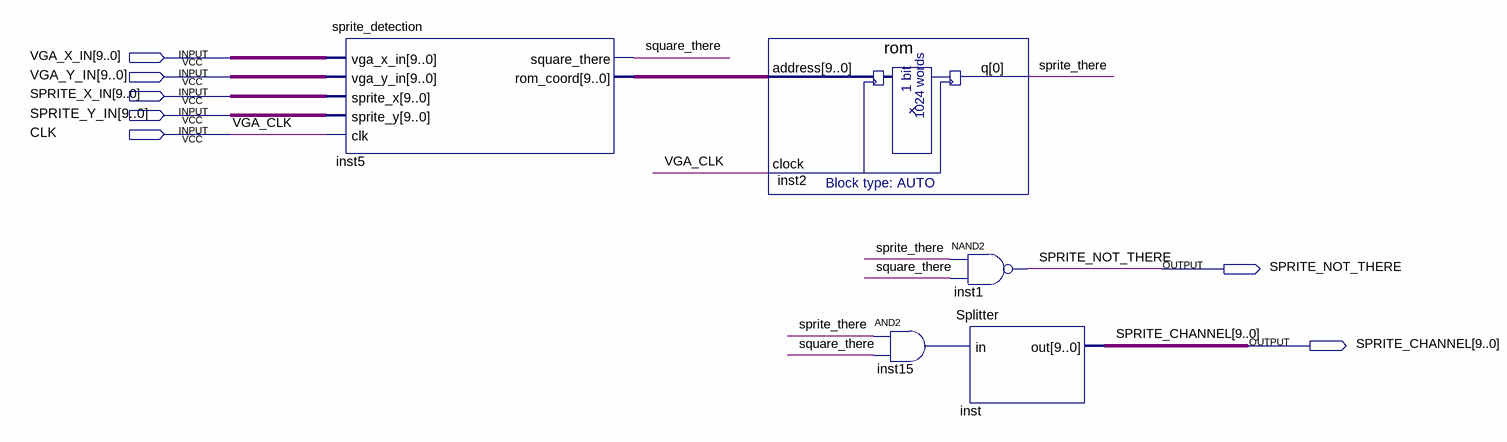
[diagram p0: schematic sheet]
// Quartus schematic sprite1.bdf as structural Verilog: 5 symbols, 7 pins
module sprite1 (
  input  [9:0] VGA_X_IN,
  input  [9:0] VGA_Y_IN,
  input  [9:0] SPRITE_X_IN,
  input  [9:0] SPRITE_Y_IN,
  input  CLK,
  output SPRITE_NOT_THERE,
  output [9:0] SPRITE_CHANNEL
);

  wire inst15_out, sprite_there, square_there;
  wire [9:0] inst5_rom_coord;

  sprite_detection inst5 (
    .vga_x_in(VGA_X_IN), .vga_y_in(VGA_Y_IN), .sprite_x(SPRITE_X_IN), .sprite_y(SPRITE_Y_IN), .clk(CLK),
    .square_there(square_there), .rom_coord(inst5_rom_coord));
  rom inst2 (.address(inst5_rom_coord), .clock(CLK), .q(sprite_there));
  and inst15 (inst15_out, sprite_there, square_there);
  nand inst1 (SPRITE_NOT_THERE, sprite_there, square_there);
  Splitter inst (.in(inst15_out), .out(SPRITE_CHANNEL));

  // Other names for the same wires on the sheet: VGA_CLK = CLK
endmodule
